# Altium schematic sheet buffNlvlshifter.SchDoc
size Letter
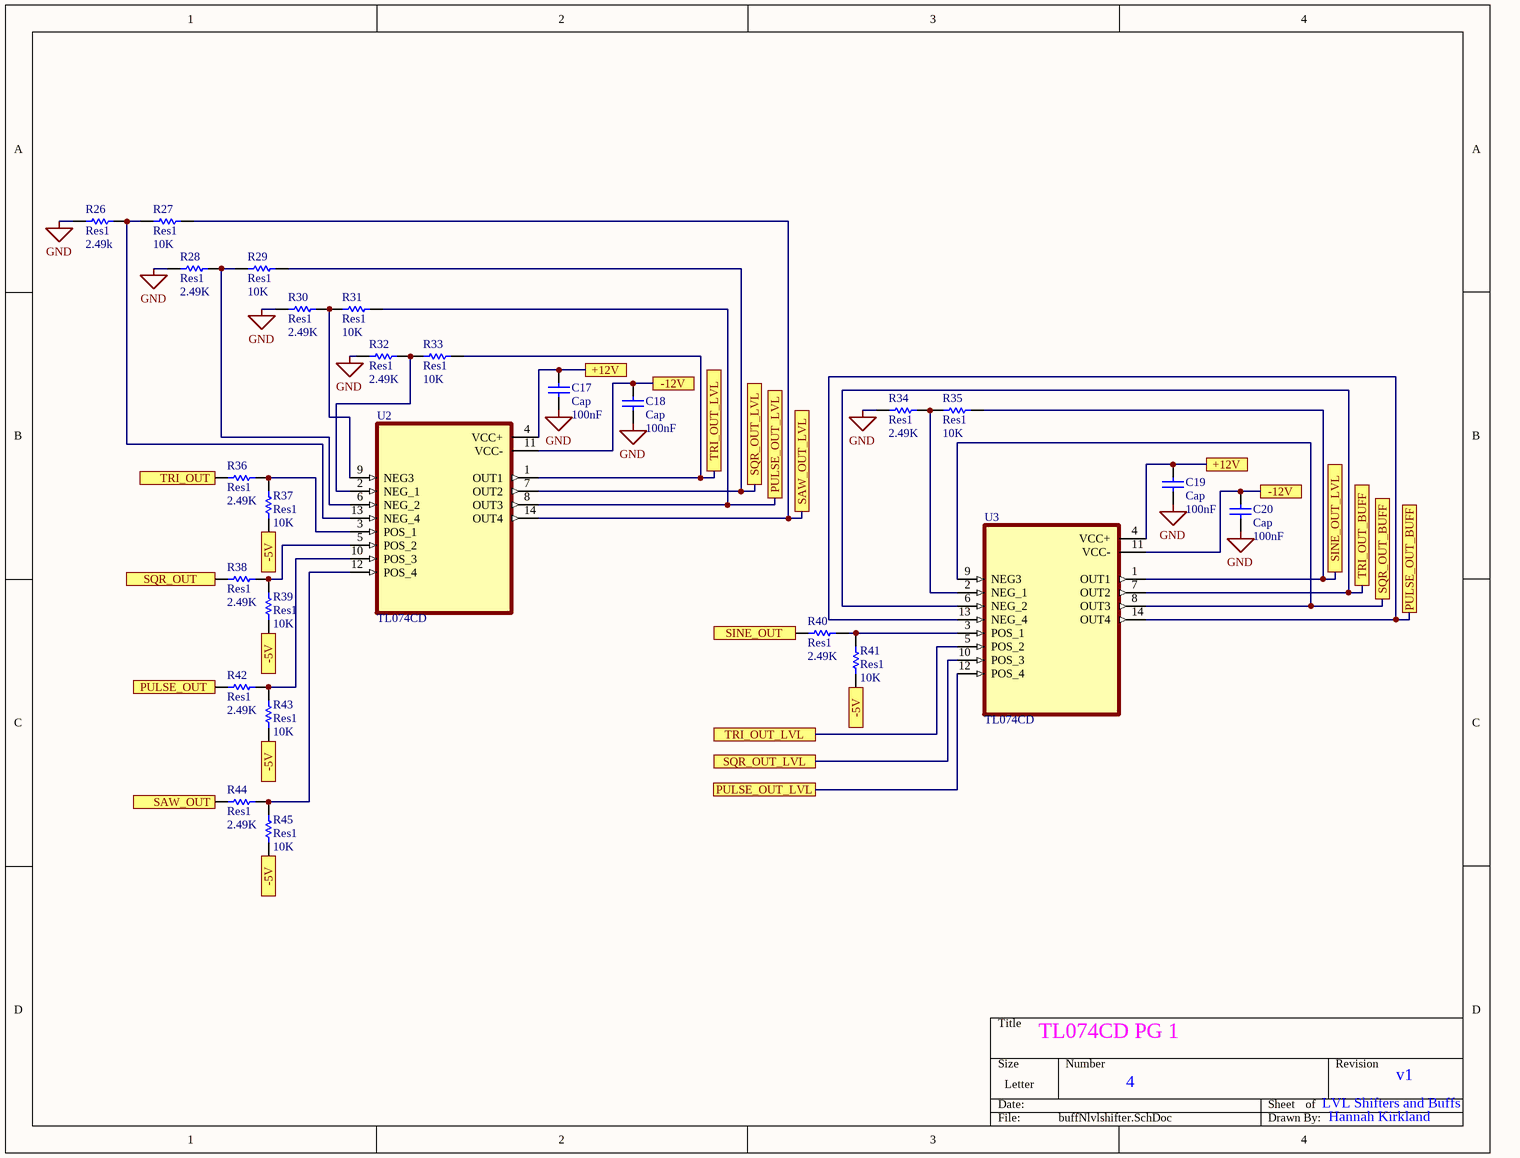
[diagram p0: buffNlvlshifter.SchDoc]

## Parts
C17  Cap  value 100nF  [C1206]
C18  Cap  value 100nF  [C1206]
C19  Cap  value 100nF  [C1206]
C20  Cap  value 100nF  [C1206]
R26  Res1  value 2.49k  [C1206]
R27  Res1  value 10K  [C1206]
R28  Res1  value 2.49K  [C1206]
R29  Res1  value 10K  [C1206]
R30  Res1  value 2.49K  [C1206]
R31  Res1  value 10K  [C1206]
R32  Res1  value 2.49K  [C1206]
R33  Res1  value 10K  [C1206]
R34  Res1  value 2.49K  [C1206]
R35  Res1  value 10K  [C1206]
R36  Res1  value 2.49K  [C1206]
R37  Res1  value 10K  [C1206]
R38  Res1  value 2.49K  [C1206]
R39  Res1  value 10K  [C1206]
R40  Res1  value 2.49K  [C1206]
R41  Res1  value 10K  [C1206]
R42  Res1  value 2.49K  [C1206]
R43  Res1  value 10K  [C1206]
R44  Res1  value 2.49K  [C1206]
R45  Res1  value 10K  [C1206]
U2  TL074CD  [SOIC127P600X175-14N]
U3  TL074CD  [SOIC127P600X175-14N]

## Ports
+12V, -5V, -12V, PULSE_OUT, PULSE_OUT_BUFF, PULSE_OUT_LVL, SAW_OUT, SAW_OUT_LVL, SINE_OUT, SINE_OUT_LVL, SQR_OUT, SQR_OUT_BUFF, SQR_OUT_LVL, TRI_OUT, TRI_OUT_BUFF, TRI_OUT_LVL

## Nets
GND: C17.1 C18.1 C19.1 C20.1 R26.1 R28.1 R30.1 R32.1 R34.1
+12V: C17.2 C19.2 U2.4(VCC+) U3.4(VCC+) ; port +12V
-5V: R37.1 R39.1 R41.1 R43.1 R45.1 ; port -5V
-12V: C18.2 C20.2 U2.11(VCC-) U3.11(VCC-) ; port -12V
PULSE_OUT: R42.1 ; port PULSE_OUT
PULSE_OUT_BUFF: U3.13(NEG_4) U3.14(OUT4) ; port PULSE_OUT_BUFF
PULSE_OUT_LVL: R31.2 U2.8(OUT3) U3.12(POS_4) ; port PULSE_OUT_LVL
SAW_OUT: R44.1 ; port SAW_OUT
SAW_OUT_LVL: R27.2 U2.14(OUT4) ; port SAW_OUT_LVL
SINE_OUT: R40.1 ; port SINE_OUT
SINE_OUT_LVL: R35.2 U3.1(OUT1) ; port SINE_OUT_LVL
SQR_OUT: R38.1 ; port SQR_OUT
SQR_OUT_BUFF: U3.8(OUT3) U3.9(NEG3) ; port SQR_OUT_BUFF
SQR_OUT_LVL: R29.2 U2.7(OUT2) U3.10(POS_3) ; port SQR_OUT_LVL
TRI_OUT: R36.1 ; port TRI_OUT
TRI_OUT_BUFF: U3.6(NEG_2) U3.7(OUT2) ; port TRI_OUT_BUFF
TRI_OUT_LVL: R33.2 U2.1(OUT1) U3.5(POS_2) ; port TRI_OUT_LVL
NetR26_2: R26.2 R27.1 U2.13(NEG_4)
NetR28_2: R28.2 R29.1 U2.6(NEG_2)
NetR30_2: R30.2 R31.1 U2.9(NEG3)
NetR32_2: R32.2 R33.1 U2.2(NEG_1)
NetR34_2: R34.2 R35.1 U3.2(NEG_1)
NetR36_2: R36.2 R37.2 U2.3(POS_1)
NetR38_2: R38.2 R39.2 U2.5(POS_2)
NetR40_2: R40.2 R41.2 U3.3(POS_1)
NetR42_2: R42.2 R43.2 U2.10(POS_3)
NetR44_2: R44.2 R45.2 U2.12(POS_4)

## Notes on the sheet
- TL074CD PG 1
- 4
- LVL Shifters and Buffs
- v1
- Hannah Kirkland

## Library data of the parts
C17-C20 = Cap: Capacitor; Published: 8-Jun-2000; LatestRevisionDate: 17-Jul-2002; LatestRevisionNote: Re-released for DXP Platform.; PackageReference: RAD-0.3; Publisher: Altium Limited; PackageDescription: Radial Cap, Thru-Hole; 2 Leads; 0.3 in Pin Spacing
R26-R45 = Res1: Resistor; Published: 8-Jun-2000; LatestRevisionDate: 17-Jul-2002; LatestRevisionNote: Re-released for DXP Platform.; PackageReference: AXIAL-0.3; Publisher: Altium Limited; PackageDescription: Axial Device, Thru-Hole; 2 Leads; 0.3 in Pin Spacing
U2 U3 = TL074CD: Quad Low-Noise JFET-Input General-Purpose Operational Amplifier 14-SOIC 0 to 70; MF: Texas Instruments; Availability: Good; Mouser-Purchase-URL: https://snapeda.com/shop?store=Mouser&id=4793449; Value: *; SnapEDA_Link: https://www.snapeda.com/parts/TL074CD/Texas%20Instruments/view-part/4793449/?ref=snap; Texas_Instruments-Purchase-URL: https://snapeda.com/shop?store=Texas+Instruments&id=4793449; Price: None; Package: SOIC-14 Texas Instruments; MP: TL074CD; DigiKey-Purchase-URL: https://snapeda.com/shop?store=DigiKey&id=4793449; BuyPart: https://www.snapeda.com/parts/TL074CD/Texas%20Instruments/view-part/4793449/?ref=eda